# EAGLE schematic SmartSensorWifi (EAGLE 6.5.0)
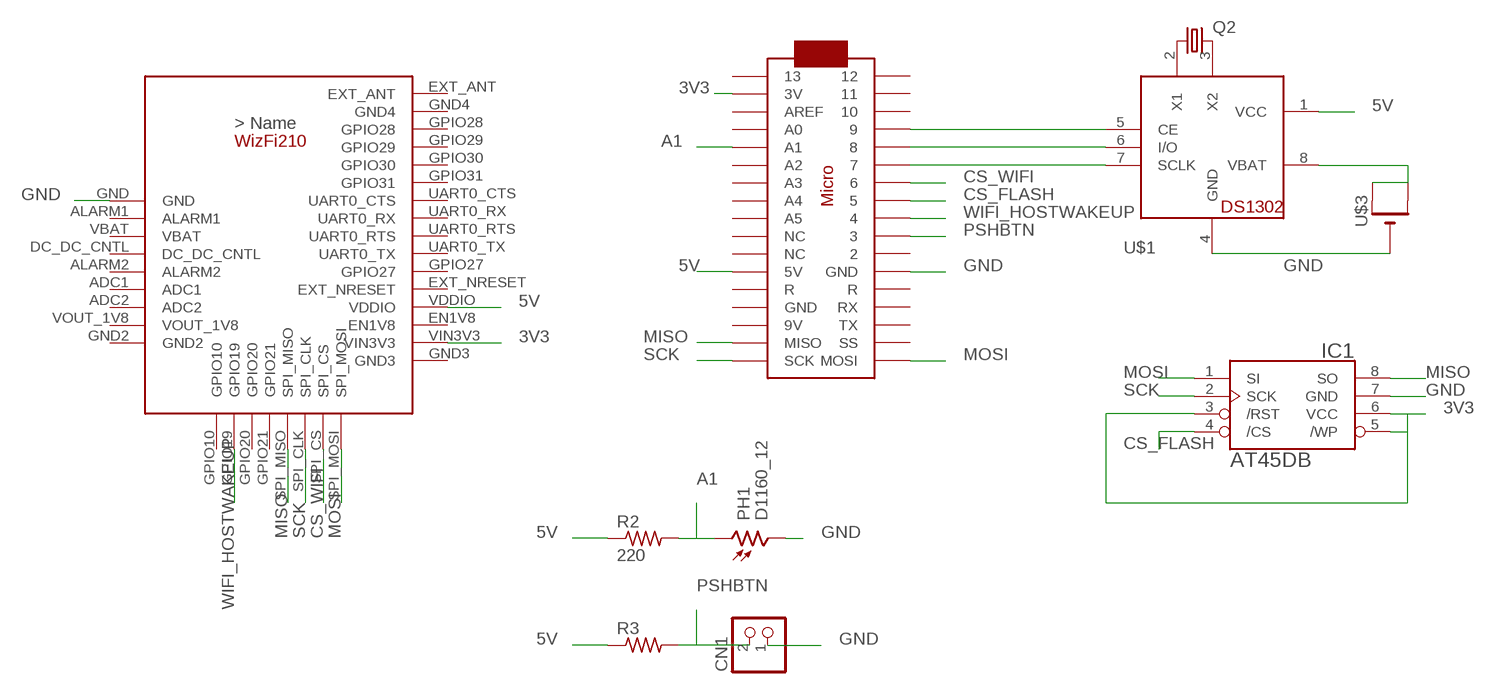
[diagram p0: schematic, sheet 1]

## Parts
CN1  JST_2PIN-THM  [JST-PH-2-THM]
IC1  AT45DB-S  [SOIC8_208MIL]
PH1  D1160_12  [D11XX]
Q2  CRYSTALTC38H  [TC38H]
R2  220  R-US_0207/12  [0207/12]
R3  R-US_0207/12  [0207/12]
U$1  DS1302  [DIL08-ROUND]
U$2  ARDUINOMICRO  [ARDUINOMICRO]
U$3  CR2032THM  [CR2032-THRU]
U$4  WIZFISTACKED  [WIZFI210STACKABLE]

## Nets
3V3: IC1.3(/RST) IC1.5(/WP) IC1.6(VCC) U$2.P$33(3V) U$4.VIN3V3
5V: R2.1 R3.1 U$1.1(VCC) U$2.P$23(5V) U$4.VDDIO
A1: PH1.1 R2.2 U$2.P$30(A1)
CS_FLASH: IC1.4(/CS) U$2.P$8
CS_WIFI: U$2.P$7 U$4.SPI_CS
GND: CN1.1 IC1.7(GND) PH1.2 U$1.4(GND) U$2.P$21(GND) U$3.- U$4.GND
MISO: IC1.8(SO) U$2.P$19(MISO) U$4.SPI_MISO
MOSI: IC1.1(SI) U$2.P$17(MOSI) U$4.SPI_MOSI
N$1: U$1.5(CE) U$2.P$4
N$2: Q2.2 U$1.3(X2)
N$3: Q2.1 U$1.2(X1)
N$4: U$1.7(SCLK) U$2.P$6
N$5: U$1.6(I/O) U$2.P$5
N$10: U$1.8(VBAT) U$3.+1(+) U$3.+2(+1)
PSHBTN: CN1.2 R3.2 U$2.P$10
SCK: IC1.2(SCK) U$2.P$18(SCK) U$4.SPI_CLK
WIFI_HOSTWAKEUP: U$2.P$9 U$4.GPIO19
Unconnected: U$2.P$1 U$2.P$2 U$2.P$3 U$2.P$11 U$2.P$12(GND) U$2.P$13(R) U$2.P$14(RX) U$2.P$15(TX) U$2.P$16(SS) U$2.P$20(9V) U$2.P$22(R) U$2.P$24(NC) U$2.P$25(NC) U$2.P$26(A5) U$2.P$27(A4) U$2.P$28(A3) U$2.P$29(A2) U$2.P$31(A0) U$2.P$32(AREF) U$2.P$34 U$4.ADC1 U$4.ADC2 U$4.ALARM1 U$4.ALARM2 U$4.DC_DC_CNTL U$4.EN1V8 U$4.EXT_ANT U$4.EXT_NRESET U$4.GPIO10 U$4.GPIO20 U$4.GPIO21 U$4.GPIO27 U$4.GPIO28 U$4.GPIO29 U$4.GPIO30 U$4.GPIO31 U$4.UART0_CTS U$4.UART0_RTS U$4.UART0_RX U$4.UART0_TX

## Power pins joined to a net without a drawn wire
GND2: U$4.GND2
GND3: U$4.GND3
GND4: U$4.GND4
VBAT: U$4.VBAT
VOUT_1V8: U$4.VOUT_1V8

## Library data of the parts
CN1 = adafruit:JST_2PIN: JST 2-Pin Connectors of various flavors SMT-RA (S2B-PH-SM4) 4UConnector #17311 SMT (B2B-PH-SM4) THM-RA (S2B-PH) THM (B2B-PH)
IC1 = adafruit:AT45DB
PH1 = photo-elements:D11: Photo Sensor Oil Burner Control Applications Source: http://optoelectronics.perkinelmer.com/content/Datasheets/DTS_PhotocellsD1160.pdf
Q2 = adafruit:CRYSTAL: CRYSTAL; OC_FARNELL: unknown; OC_NEWARK: unknown
R2 R3 = adafruit:R-US_: RESISTOR, American symbol
U$1 = adafruit:DS1302: DS1302 - Real time clock with supercap trickle charger
U$2 = adafruit:ARDUINOMICRO
U$3 = adafruit:CR2032
U$4 = SmartSensorWifi:WIZFISTACKED